# Altium schematic sheet Zynq_Power.SchDoc: Zynq Power
size A3; DrawnBy: Emre Can Damyanlı; Revision: A.1; SheetNumber: 3; SheetTotal: 4; ENG_APP_DATE: --/--/--; DSN_APP_DATE: --/--/--; CHK_APP_DATE: --/--/--
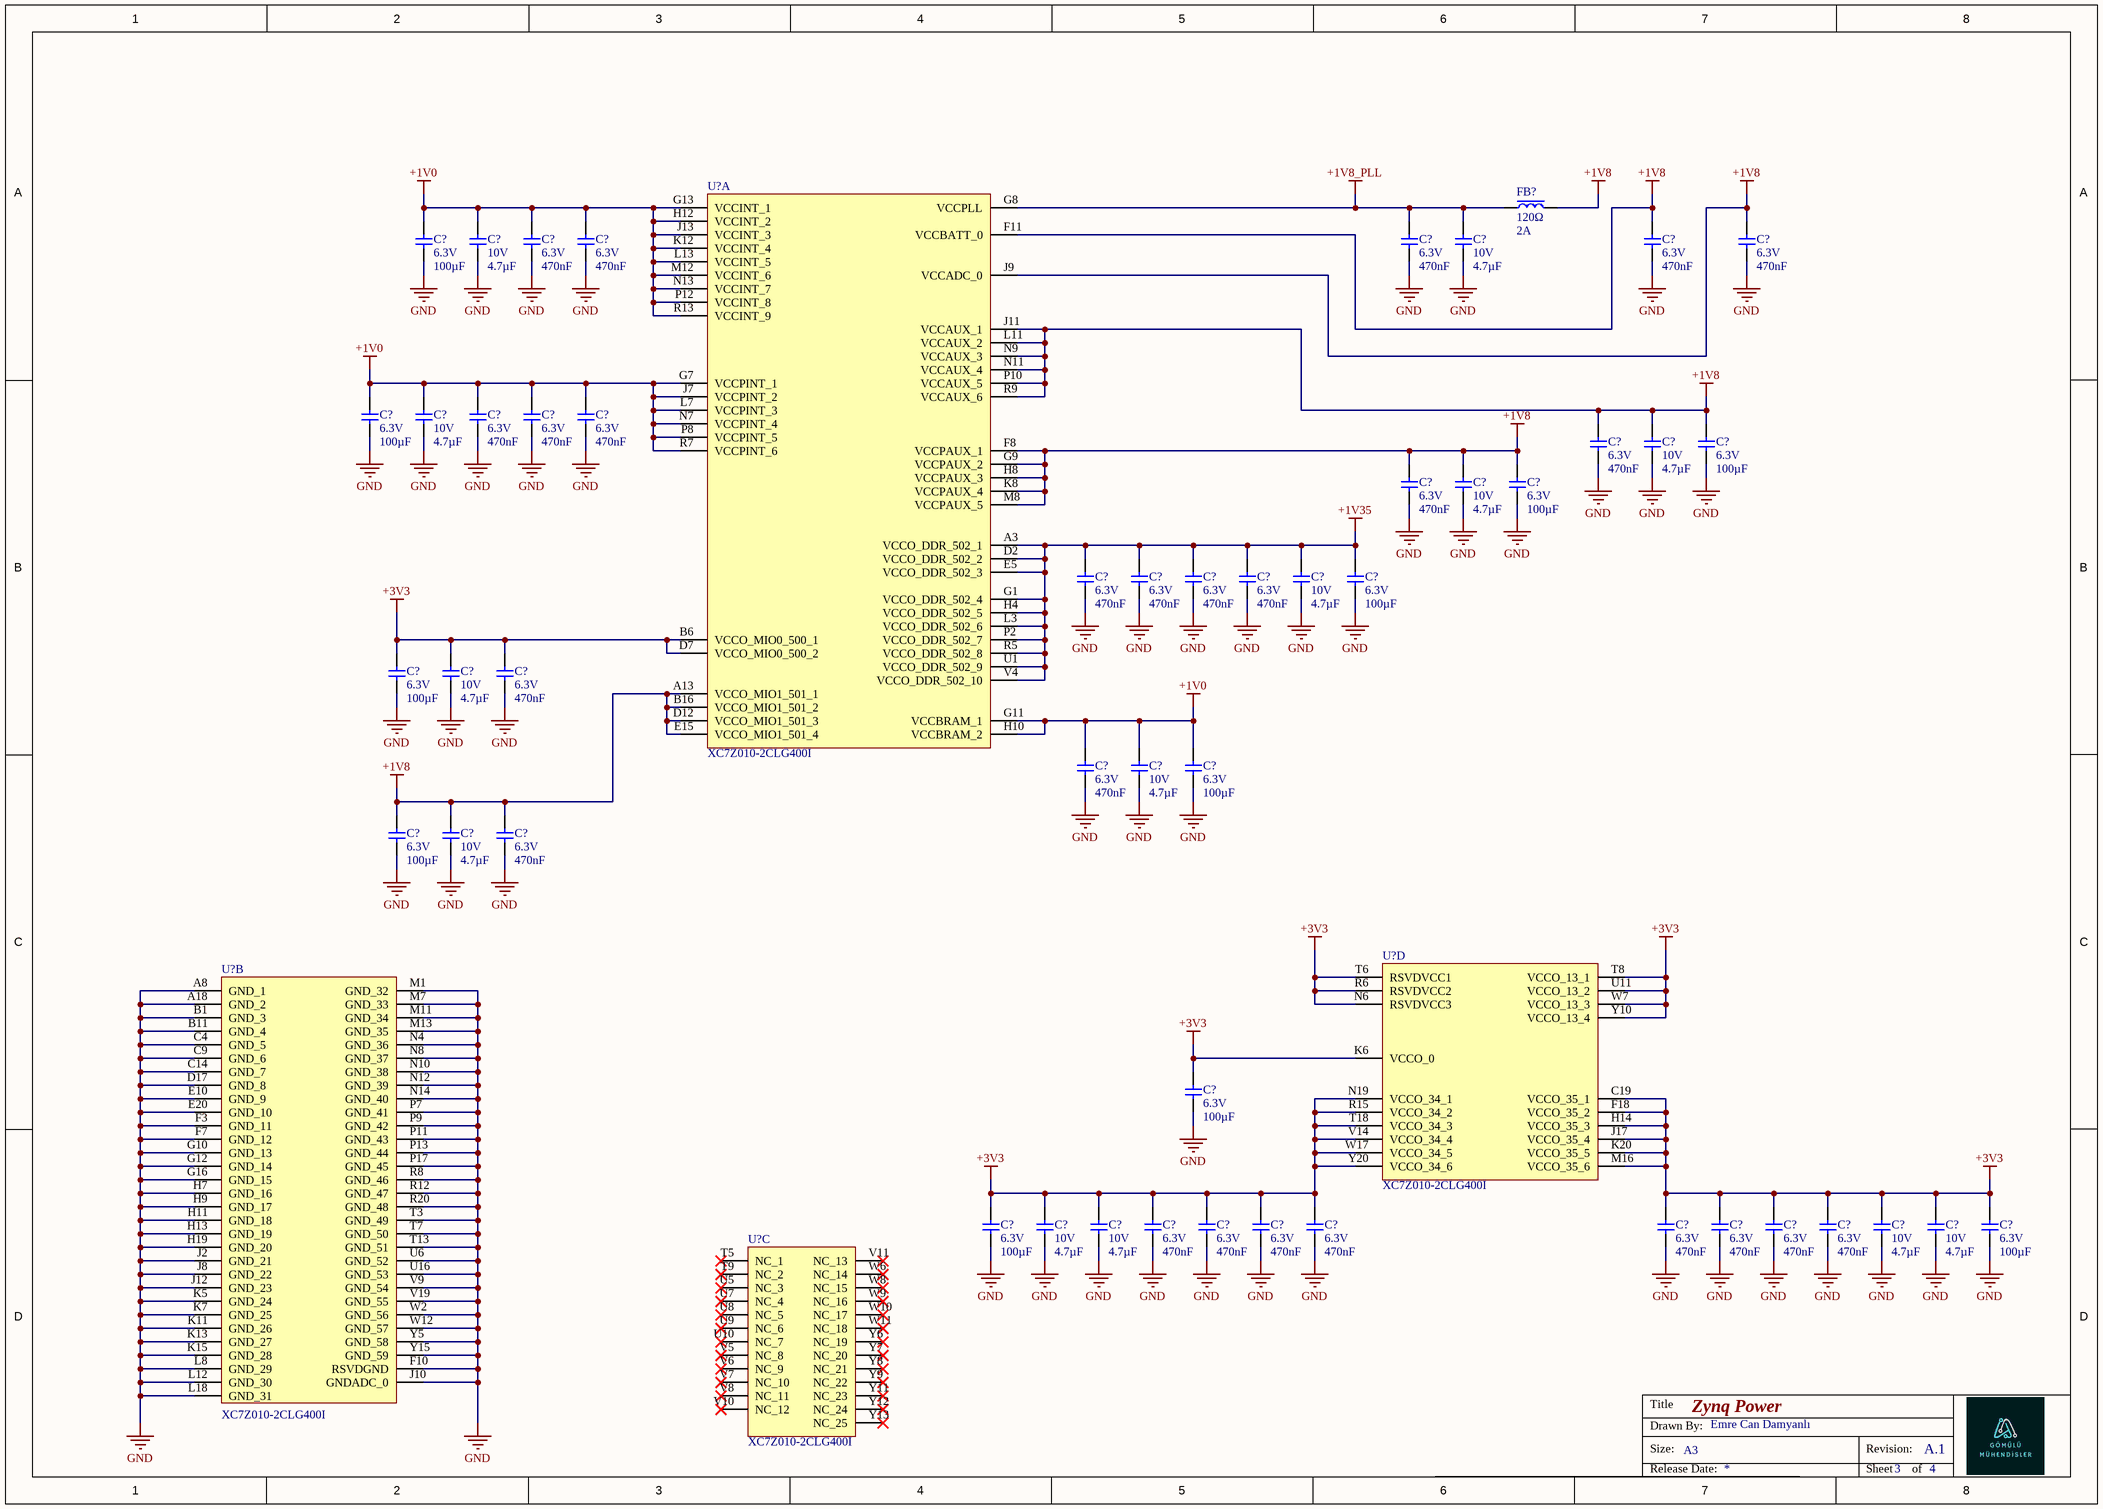
[diagram p0: Zynq_Power.SchDoc]

## Parts
(Parts that share a designator on the sheet are numbered #1, #2 ... from top to bottom, then left to right.)
C?#1  value 100µF  Voltage: 6.3V  [CAPC3225X140N]  (hidden comment: CL32A107MQVNNNE)
C?#2  value 4.7µF  Voltage Rating: 10V  [CAPC1005X55N]  (hidden comment: CL05A475MP5NRNC)
C?#3  value 470nF  Voltage Rating: 6.3V  [CAPC0603X33N]  (hidden comment: GRM033R60J474KE90D)
C?#4  value 470nF  Voltage Rating: 6.3V  [CAPC0603X33N]  (hidden comment: GRM033R60J474KE90D)
C?#5  value 470nF  Voltage Rating: 6.3V  [CAPC0603X33N]  (hidden comment: GRM033R60J474KE90D)
C?#6  value 4.7µF  Voltage Rating: 10V  [CAPC1005X55N]  (hidden comment: CL05A475MP5NRNC)
C?#7  value 470nF  Voltage Rating: 6.3V  [CAPC0603X33N]  (hidden comment: GRM033R60J474KE90D)
C?#8  value 470nF  Voltage Rating: 6.3V  [CAPC0603X33N]  (hidden comment: GRM033R60J474KE90D)
C?#9  value 100µF  Voltage: 6.3V  [CAPC3225X140N]  (hidden comment: CL32A107MQVNNNE)
C?#10  value 4.7µF  Voltage Rating: 10V  [CAPC1005X55N]  (hidden comment: CL05A475MP5NRNC)
C?#11  value 470nF  Voltage Rating: 6.3V  [CAPC0603X33N]  (hidden comment: GRM033R60J474KE90D)
C?#12  value 470nF  Voltage Rating: 6.3V  [CAPC0603X33N]  (hidden comment: GRM033R60J474KE90D)
C?#13  value 470nF  Voltage Rating: 6.3V  [CAPC0603X33N]  (hidden comment: GRM033R60J474KE90D)
C?#14  value 470nF  Voltage Rating: 6.3V  [CAPC0603X33N]  (hidden comment: GRM033R60J474KE90D)
C?#15  value 4.7µF  Voltage Rating: 10V  [CAPC1005X55N]  (hidden comment: CL05A475MP5NRNC)
C?#16  value 100µF  Voltage: 6.3V  [CAPC3225X140N]  (hidden comment: CL32A107MQVNNNE)
C?#17  value 470nF  Voltage Rating: 6.3V  [CAPC0603X33N]  (hidden comment: GRM033R60J474KE90D)
C?#18  value 4.7µF  Voltage Rating: 10V  [CAPC1005X55N]  (hidden comment: CL05A475MP5NRNC)
C?#19  value 100µF  Voltage: 6.3V  [CAPC3225X140N]  (hidden comment: CL32A107MQVNNNE)
C?#20  value 470nF  Voltage Rating: 6.3V  [CAPC0603X33N]  (hidden comment: GRM033R60J474KE90D)
C?#21  value 470nF  Voltage Rating: 6.3V  [CAPC0603X33N]  (hidden comment: GRM033R60J474KE90D)
C?#22  value 470nF  Voltage Rating: 6.3V  [CAPC0603X33N]  (hidden comment: GRM033R60J474KE90D)
C?#23  value 470nF  Voltage Rating: 6.3V  [CAPC0603X33N]  (hidden comment: GRM033R60J474KE90D)
C?#24  value 4.7µF  Voltage Rating: 10V  [CAPC1005X55N]  (hidden comment: CL05A475MP5NRNC)
C?#25  value 100µF  Voltage: 6.3V  [CAPC3225X140N]  (hidden comment: CL32A107MQVNNNE)
C?#26  value 100µF  Voltage: 6.3V  [CAPC3225X140N]  (hidden comment: CL32A107MQVNNNE)
C?#27  value 4.7µF  Voltage Rating: 10V  [CAPC1005X55N]  (hidden comment: CL05A475MP5NRNC)
C?#28  value 470nF  Voltage Rating: 6.3V  [CAPC0603X33N]  (hidden comment: GRM033R60J474KE90D)
C?#29  value 470nF  Voltage Rating: 6.3V  [CAPC0603X33N]  (hidden comment: GRM033R60J474KE90D)
C?#30  value 4.7µF  Voltage Rating: 10V  [CAPC1005X55N]  (hidden comment: CL05A475MP5NRNC)
C?#31  value 100µF  Voltage: 6.3V  [CAPC3225X140N]  (hidden comment: CL32A107MQVNNNE)
C?#32  value 100µF  Voltage: 6.3V  [CAPC3225X140N]  (hidden comment: CL32A107MQVNNNE)
C?#33  value 4.7µF  Voltage Rating: 10V  [CAPC1005X55N]  (hidden comment: CL05A475MP5NRNC)
C?#34  value 470nF  Voltage Rating: 6.3V  [CAPC0603X33N]  (hidden comment: GRM033R60J474KE90D)
C?#35  value 100µF  Voltage: 6.3V  [CAPC3225X140N]  (hidden comment: CL32A107MQVNNNE)
C?#36  value 100µF  Voltage: 6.3V  [CAPC3225X140N]  (hidden comment: CL32A107MQVNNNE)
C?#37  value 4.7µF  Voltage Rating: 10V  [CAPC1005X55N]  (hidden comment: CL05A475MP5NRNC)
C?#38  value 4.7µF  Voltage Rating: 10V  [CAPC1005X55N]  (hidden comment: CL05A475MP5NRNC)
C?#39  value 470nF  Voltage Rating: 6.3V  [CAPC0603X33N]  (hidden comment: GRM033R60J474KE90D)
C?#40  value 470nF  Voltage Rating: 6.3V  [CAPC0603X33N]  (hidden comment: GRM033R60J474KE90D)
C?#41  value 470nF  Voltage Rating: 6.3V  [CAPC0603X33N]  (hidden comment: GRM033R60J474KE90D)
C?#42  value 470nF  Voltage Rating: 6.3V  [CAPC0603X33N]  (hidden comment: GRM033R60J474KE90D)
C?#43  value 470nF  Voltage Rating: 6.3V  [CAPC0603X33N]  (hidden comment: GRM033R60J474KE90D)
C?#44  value 470nF  Voltage Rating: 6.3V  [CAPC0603X33N]  (hidden comment: GRM033R60J474KE90D)
C?#45  value 470nF  Voltage Rating: 6.3V  [CAPC0603X33N]  (hidden comment: GRM033R60J474KE90D)
C?#46  value 470nF  Voltage Rating: 6.3V  [CAPC0603X33N]  (hidden comment: GRM033R60J474KE90D)
C?#47  value 4.7µF  Voltage Rating: 10V  [CAPC1005X55N]  (hidden comment: CL05A475MP5NRNC)
C?#48  value 4.7µF  Voltage Rating: 10V  [CAPC1005X55N]  (hidden comment: CL05A475MP5NRNC)
C?#49  value 100µF  Voltage: 6.3V  [CAPC3225X140N]  (hidden comment: CL32A107MQVNNNE)
FB?  Impedance: 120Ω  Max Current Rating: 2A  [FERRITE_0402]  (hidden comment: BLM15PX121SN1D)
U?#1  XC7Z010-2CLG400I  [BGA400C80P20X20_1700X1700X160]  (part A of 9)
U?#2  XC7Z010-2CLG400I  [BGA400C80P20X20_1700X1700X160]  (part D of 9)
U?#3  XC7Z010-2CLG400I  [BGA400C80P20X20_1700X1700X160]  (part B of 9)
U?#4  XC7Z010-2CLG400I  [BGA400C80P20X20_1700X1700X160]  (part C of 9)

## Nets
+1V0: C?#1.2 C?#2.2 C?#3.2 C?#4.2 C?#9.2 C?#10.2 C?#11.2 C?#12.2 C?#13.2 C?#29.2 C?#30.2 C?#31.2 U?#1.G7(VCCPINT_1) U?#1.G11(VCCBRAM_1) U?#1.G13(VCCINT_1) U?#1.H10(VCCBRAM_2) U?#1.H12(VCCINT_2) U?#1.J7(VCCPINT_2) U?#1.J13(VCCINT_3) U?#1.K12(VCCINT_4) U?#1.L7(VCCPINT_3) U?#1.L13(VCCINT_5) U?#1.M12(VCCINT_6) U?#1.N7(VCCPINT_4) U?#1.N13(VCCINT_7) U?#1.P8(VCCPINT_5) U?#1.P12(VCCINT_8) U?#1.R7(VCCPINT_6) U?#1.R13(VCCINT_9)
+1V8: C?#7.2 C?#8.2 C?#14.2 C?#15.2 C?#16.2 C?#17.2 C?#18.2 C?#19.2 C?#32.2 C?#33.2 C?#34.2 FB?.2 U?#1.A13(VCCO_MIO1_501_1) U?#1.B16(VCCO_MIO1_501_2) U?#1.D12(VCCO_MIO1_501_3) U?#1.E15(VCCO_MIO1_501_4) U?#1.F8(VCCPAUX_1) U?#1.F11(VCCBATT_0) U?#1.G9(VCCPAUX_2) U?#1.H8(VCCPAUX_3) U?#1.J9(VCCADC_0) U?#1.J11(VCCAUX_1) U?#1.K8(VCCPAUX_4) U?#1.L11(VCCAUX_2) U?#1.M8(VCCPAUX_5) U?#1.N9(VCCAUX_3) U?#1.N11(VCCAUX_4) U?#1.P10(VCCAUX_5) U?#1.R9(VCCAUX_6)
+1V8_PLL: C?#5.2 C?#6.2 FB?.1 U?#1.G8(VCCPLL)
+1V35: C?#20.2 C?#21.2 C?#22.2 C?#23.2 C?#24.2 C?#25.2 U?#1.A3(VCCO_DDR_502_1) U?#1.D2(VCCO_DDR_502_2) U?#1.E5(VCCO_DDR_502_3) U?#1.G1(VCCO_DDR_502_4) U?#1.H4(VCCO_DDR_502_5) U?#1.L3(VCCO_DDR_502_6) U?#1.P2(VCCO_DDR_502_7) U?#1.R5(VCCO_DDR_502_8) U?#1.U1(VCCO_DDR_502_9) U?#1.V4(VCCO_DDR_502_10)
+3V3: C?#26.2 C?#27.2 C?#28.2 C?#35.2 C?#36.2 C?#37.2 C?#38.2 C?#39.2 C?#40.2 C?#41.2 C?#42.2 C?#43.2 C?#44.2 C?#45.2 C?#46.2 C?#47.2 C?#48.2 C?#49.2 U?#1.B6(VCCO_MIO0_500_1) U?#1.D7(VCCO_MIO0_500_2) U?#2.C19(VCCO_35_1) U?#2.F18(VCCO_35_2) U?#2.H14(VCCO_35_3) U?#2.J17(VCCO_35_4) U?#2.K6(VCCO_0) U?#2.K20(VCCO_35_5) U?#2.M16(VCCO_35_6) U?#2.N6(RSVDVCC3) U?#2.N19(VCCO_34_1) U?#2.R6(RSVDVCC2) U?#2.R15(VCCO_34_2) U?#2.T6(RSVDVCC1) U?#2.T8(VCCO_13_1) U?#2.T18(VCCO_34_3) U?#2.U11(VCCO_13_2) U?#2.V14(VCCO_34_4) U?#2.W7(VCCO_13_3) U?#2.W17(VCCO_34_5) U?#2.Y10(VCCO_13_4) U?#2.Y20(VCCO_34_6)
GND: C?#1.1 C?#2.1 C?#3.1 C?#4.1 C?#5.1 C?#6.1 C?#7.1 C?#8.1 C?#9.1 C?#10.1 C?#11.1 C?#12.1 C?#13.1 C?#14.1 C?#15.1 C?#16.1 C?#17.1 C?#18.1 C?#19.1 C?#20.1 C?#21.1 C?#22.1 C?#23.1 C?#24.1 C?#25.1 C?#26.1 C?#27.1 C?#28.1 C?#29.1 C?#30.1 C?#31.1 C?#32.1 C?#33.1 C?#34.1 C?#35.1 C?#36.1 C?#37.1 C?#38.1 C?#39.1 C?#40.1 C?#41.1 C?#42.1 C?#43.1 C?#44.1 C?#45.1 C?#46.1 C?#47.1 C?#48.1 C?#49.1 U?#3.A8(GND_1) U?#3.A18(GND_2) U?#3.B1(GND_3) U?#3.B11(GND_4) U?#3.C4(GND_5) U?#3.C9(GND_6) U?#3.C14(GND_7) U?#3.D17(GND_8) U?#3.E10(GND_9) U?#3.E20(GND_10) U?#3.F3(GND_11) U?#3.F7(GND_12) U?#3.F10(RSVDGND) U?#3.G10(GND_13) U?#3.G12(GND_14) U?#3.G16(GND_15) U?#3.H7(GND_16) U?#3.H9(GND_17) U?#3.H11(GND_18) U?#3.H13(GND_19) U?#3.H19(GND_20) U?#3.J2(GND_21) U?#3.J8(GND_22) U?#3.J10(GNDADC_0) U?#3.J12(GND_23) U?#3.K5(GND_24) U?#3.K7(GND_25) U?#3.K11(GND_26) U?#3.K13(GND_27) U?#3.K15(GND_28) U?#3.L8(GND_29) U?#3.L12(GND_30) U?#3.L18(GND_31) U?#3.M1(GND_32) U?#3.M7(GND_33) U?#3.M11(GND_34) U?#3.M13(GND_35) U?#3.N4(GND_36) U?#3.N8(GND_37) U?#3.N10(GND_38) U?#3.N12(GND_39) U?#3.N14(GND_40) U?#3.P7(GND_41) U?#3.P9(GND_42) U?#3.P11(GND_43) U?#3.P13(GND_44) U?#3.P17(GND_45) U?#3.R8(GND_46) U?#3.R12(GND_47) U?#3.R20(GND_48) U?#3.T3(GND_49) U?#3.T7(GND_50) U?#3.T13(GND_51) U?#3.U6(GND_52) U?#3.U16(GND_53) U?#3.V9(GND_54) U?#3.V19(GND_55) U?#3.W2(GND_56) U?#3.W12(GND_57) U?#3.Y5(GND_58) U?#3.Y15(GND_59)

Not connected (* = marked no-connect by the designer): U?#4 T5(NC_1)* T9(NC_2)* U5(NC_3)* U7(NC_4)* U8(NC_5)* U9(NC_6)* U10(NC_7)* V5(NC_8)* V6(NC_9)* V7(NC_10)* V8(NC_11)* V10(NC_12)* V11(NC_13)* W6(NC_14)* W8(NC_15)* W9(NC_16)* W10(NC_17)* W11(NC_18)* Y6(NC_19)* Y7(NC_20)* Y8(NC_21)* Y9(NC_22)* Y11(NC_23)* Y12(NC_24)* Y13(NC_25)*

## Notes on the sheet
- Title
- Size:
- Drawn By:
- A3
- Revision:
- Release Date:
- Sheet
- of

## Library data of the parts
C?#1 C?#9 C?#16 C?#19 C?#25 C?#26 C?#31 C?#32 C?#35 C?#36 C?#49 = CL32A107MQVNNNE: 6.3V 100uF X5R ±20% 1210 Multilayer Ceramic Capacitors MLCC - SMD/SMT ROHS; Manufacturer: Samsung Electro-Mechanics; Supplier: Avnet; Supplier Part Number: 82AC9521; Manufacturer Part Number: CL32A107MQVNNNE; RoHS: Compliant; Category: Ceramic Capacitors; Stock: 76691; Pricing: 1=0,707, 10=0,427, 25=0,371, 50=0,315, 100=0,28 (USD); Case/Package: 1210; Case Code (Imperial): 1210; Case Code (Metric): 3225; China RoHS: Compliant; Contact Plating: Tin; Depth: 2.5mm; Dielectric: X5R; Dielectric Material: Ceramic; Height: 2.8mm; Lead Free: Lead Free; Length: 3.2mm; Lifecycle Status: Production; Material: Ceramic; Max Operating Temperature: 85°C; Min Operating Temperature: -55°C; Mounting Technology: Surface Mount; Number of Terminals: 2; Radiation Hardening: No; REACH SVHC: Yes; Schedule B: 8532240020, 8532240020|8532240020|8532240020|8532240020|8532240020|8532240020|8532240020|8532240020|8532240020|8532240020|8532240020|8532240020|8532240020|8532240020|8532240020|8532240020|8532240020|8532240020|8532240020|8532240020|8532240020|8532240020|8532240020|85; Thickness: 2.794mm; Tolerance: 20%; Voltage Rating: 6.3V; Voltage Rating (DC): 6.3V; Width: 2.5mm; ComponentLink1URL: https://datasheet.octopart.com:443/CL32A107MQVNNNE-Samsung-Electro-Mechanics-datasheet-181552186.pdf?src-supplier=Farnell; ComponentLink1Description: https://datasheet.octopart.com:443/CL32A107MQVNNNE-Samsung-Electro-Mechanics-datasheet-181552186.pdf?src-supplier=Farnell; ComponentLink2URL: https://datasheet.octopart.com:443/CL32A107MQVNNNE-Samsung-Electro-Mechanics-datasheet-136031867.pdf?src-supplier=Samsung+SCT; ComponentLink2Description: https://datasheet.octopart.com:443/CL32A107MQVNNNE-Samsung-Electro-Mechanics-datasheet-136031867.pdf?src-supplier=Samsung+SCT; ComponentLink3URL: https://datasheet.octopart.com:443/CL32A107MQVNNNE-Samsung-Electro-Mechanics-datasheet-11731531.pdf?src-supplier=Future+Electronics; ComponentLink3Description: https://datasheet.octopart.com:443/CL32A107MQVNNNE-Samsung-Electro-Mechanics-datasheet-11731531.pdf?src-supplier=Future+Electronics; ComponentLink4URL: https://datasheet.octopart.com:443/CL32A107MQVNNNE-Samsung-Electro-Mechanics-datasheet-149048019.pdf?src-supplier=Future+Electronics; ComponentLink4Description: https://datasheet.octopart.com:443/CL32A107MQVNNNE-Samsung-Electro-Mechanics-datasheet-149048019.pdf?src-supplier=Future+Electronics; ComponentLink5URL: https://datasheet.octopart.com:443/CL32A107MQVNNNE-Samsung-Electro-Mechanics-datasheet-110334290.pdf?src-supplier=Future+Electronics; ComponentLink5Description: https://datasheet.octopart.com:443/CL32A107MQVNNNE-Samsung-Electro-Mechanics-datasheet-110334290.pdf?src-supplier=Future+Electronics; ComponentLink6URL: https://datasheet.octopart.com:443/CL32A107MQVNNNE-Samsung-Electro-Mechanics-datasheet-81462611.pdf?src-supplier=Future+Electronics; ComponentLink6Description: https://datasheet.octopart.com:443/CL32A107MQVNNNE-Samsung-Electro-Mechanics-datasheet-81462611.pdf?src-supplier=Future+Electronics; ComponentLink7URL: https://datasheet.octopart.com:443/CL32A107MQVNNNE-Samsung-datasheet-48757337.pdf?src-supplier=Future+Electronics; ComponentLink7Description: https://datasheet.octopart.com:443/CL32A107MQVNNNE-Samsung-datasheet-48757337.pdf?src-supplier=Future+Electronics; ComponentLink8URL: https://datasheet.octopart.com:443/CL32A107MQVNNNE-Samsung-datasheet-34175070.pdf?src-supplier=Future+Electronics; ComponentLink8Description: https://datasheet.octopart.com:443/CL32A107MQVNNNE-Samsung-datasheet-34175070.pdf?src-supplier=Future+Electronics; ComponentLink9URL: https://datasheet.octopart.com/CL32A107MQVNNNE-Samsung-Electro-Mechanics-datasheet-8324245.pdf; ComponentLink9Description: https://datasheet.octopart.com/CL32A107MQVNNNE-Samsung-Electro-Mechanics-datasheet-8324245.pdf; ComponentLink10URL: https://datasheet.octopart.com/CL32A107MQVNNNE-Samsung-Electro-Mechanics-datasheet-97040617.pdf; ComponentLink10Description: https://datasheet.octopart.com/CL32A107MQVNNNE-Samsung-Electro-Mechanics-datasheet-97040617.pdf; ComponentLink11URL: https://datasheet.octopart.com/General-Multilayer-Ceramic-Capacitors-Samsung-datasheet-family-111.pdf; ComponentLink11Description: https://datasheet.octopart.com/General-Multilayer-Ceramic-Capacitors-Samsung-datasheet-family-111.pdf; ComponentLink12URL: https://datasheet.octopart.com:443/CL32A107MQVNNNE-Samsung-datasheet-151956601.pdf?src-supplier=SOS+electronic; ComponentLink12Description: https://datasheet.octopart.com:443/CL32A107MQVNNNE-Samsung-datasheet-151956601.pdf?src-supplier=SOS+electronic; ComponentLink13URL: https://datasheet.octopart.com:443/CL32A107MQVNNNE-Samsung-datasheet-151956603.pdf?src-supplier=SOS+electronic; ComponentLink13Description: https://datasheet.octopart.com:443/CL32A107MQVNNNE-Samsung-datasheet-151956603.pdf?src-supplier=SOS+electronic; ComponentLink14URL: https://datasheet.octopart.com:443/CL32A107MQVNNNE-Samsung-datasheet-8326407.pdf?src-supplier=TME; ComponentLink14Description: https://datasheet.octopart.com:443/CL32A107MQVNNNE-Samsung-datasheet-8326407.pdf?src-supplier=TME; ComponentLink15URL: http://sigma.octopart.com:80/rohs_certificate/General-Multilayer-Ceramic-Capacitors-Samsung-family-110.pdf?src-supplier=Compliance+Statements; ComponentLink15Description: http://sigma.octopart.com:80/rohs_certificate/General-Multilayer-Ceramic-Capacitors-Samsung-family-110.pdf?src-supplier=Compliance+Statements; ComponentLink16URL: http://sigma.octopart.com:80/rohs_statement/General-Multilayer-Ceramic-Capacitors-Samsung-family-132.pdf?src-supplier=Compliance+Statements; ComponentLink16Description: http://sigma.octopart.com:80/rohs_statement/General-Multilayer-Ceramic-Capacitors-Samsung-family-132.pdf?src-supplier=Compliance+Statements; ComponentLink17URL: http://sigma.octopart.com:80/reach_statement/General-Multilayer-Ceramic-Capacitors-Samsung-family-133.pdf?src-supplier=Compliance+Statements; ComponentLink17Description: http://sigma.octopart.com:80/reach_statement/General-Multilayer-Ceramic-Capacitors-Samsung-family-133.pdf?src-supplier=Compliance+Statements
C?#2 C?#6 C?#10 C?#15 C?#18 C?#24 C?#27 C?#30 C?#33 C?#37 C?#38 C?#47 C?#48 = CL05A475MP5NRNC: Ceramic Capacitor, Multilayer, Ceramic, 10V, 20% +Tol, 20% -Tol, X5R, +-15% TC, 4.7uF, Surface Mount, 0402 inch; Manufacturer: Samsung Electro-Mechanics; Supplier: Avnet; Supplier Part Number: CL05A475MP5NRNC; Manufacturer Part Number: CL05A475MP5NRNC; RoHS: Compliant; Category: Ceramic Capacitors; Stock: 40000; Pricing: 10000=0,00671, 20000=0,00663, 40000=0,0066, 80000=0,00656, 160000=0,00653 (USD); Case/Package: 0402; Case Code (Imperial): 0402; Case Code (Metric): 1005; China RoHS: Compliant; Dielectric: X5R; Dielectric Material: Ceramic; Height: 500µm; Lead Free: Lead Free; Length: 1mm; Lifecycle Status: Production; Material: Ceramic; Max Operating Temperature: 85°C; Min Operating Temperature: -55°C; Mounting Technology: Surface Mount; Number of Terminals: 2; REACH SVHC: Yes; Schedule B: 8532240020, 8532240020|8532240020|8532240020|8532240020|8532240020|8532240020|8532240020|8532240020|8532240020|8532240020|8532240020|8532240020|8532240020|8532240020|8532240020|8532240020|8532240020|8532240020|8532240020|8532240020|8532240020|8532240020, 8532240020|8532240020|8532240020|8532240020|8532240020|8532240020|8532240020|8532240020|8532240020|8532240020|8532240020|8532240020|8532240020|8532240020|8532240020|8532240020|8532240020|8532240020|8532240020|8532240020|8532240020|8532240020|8532240020, 8532240020|8532240020|8532240020|8532240020|8532240020|8532240020|8532240020|8532240020|8532240020|8532240020|8532240020|8532240020|8532240020|8532240020|8532240020|8532240020|8532240020|8532240020|8532240020|8532240020|8532240020|8532240020|8532240020|85; Thickness: 558.8µm; Tolerance: 20%; Voltage Rating (DC): 10V; Width: 500µm; ComponentLink1URL: https://datasheet.octopart.com:443/CL05A475MP5NRNC-Samsung-Electro-Mechanics-datasheet-181551186.pdf?src-supplier=Newark; ComponentLink1Description: https://datasheet.octopart.com:443/CL05A475MP5NRNC-Samsung-Electro-Mechanics-datasheet-181551186.pdf?src-supplier=Newark; ComponentLink2URL: https://datasheet.octopart.com:443/CL05A475MP5NRNC-Samsung-Electro-Mechanics-datasheet-136482298.pdf?src-supplier=Newark; ComponentLink2Description: https://datasheet.octopart.com:443/CL05A475MP5NRNC-Samsung-Electro-Mechanics-datasheet-136482298.pdf?src-supplier=Newark; ComponentLink3URL: https://datasheet.octopart.com:443/CL05A475MP5NRNC-Samsung-Electro-Mechanics-datasheet-136031736.pdf?src-supplier=Future+Electronics; ComponentLink3Description: https://datasheet.octopart.com:443/CL05A475MP5NRNC-Samsung-Electro-Mechanics-datasheet-136031736.pdf?src-supplier=Future+Electronics; ComponentLink4URL: https://datasheet.octopart.com:443/CL05A475MP5NRNC-Samsung-Electro-Mechanics-datasheet-110226226.pdf?src-supplier=Future+Electronics; ComponentLink4Description: https://datasheet.octopart.com:443/CL05A475MP5NRNC-Samsung-Electro-Mechanics-datasheet-110226226.pdf?src-supplier=Future+Electronics; ComponentLink5URL: https://datasheet.octopart.com:443/CL05A475MP5NRNC-Samsung-Electro-Mechanics-datasheet-87580058.pdf?src-supplier=Future+Electronics; ComponentLink5Description: https://datasheet.octopart.com:443/CL05A475MP5NRNC-Samsung-Electro-Mechanics-datasheet-87580058.pdf?src-supplier=Future+Electronics; ComponentLink6URL: https://datasheet.octopart.com:443/CL05A475MP5NRNC-Samsung-Electro-Mechanics-datasheet-81461611.pdf?src-supplier=Future+Electronics; ComponentLink6Description: https://datasheet.octopart.com:443/CL05A475MP5NRNC-Samsung-Electro-Mechanics-datasheet-81461611.pdf?src-supplier=Future+Electronics; ComponentLink7URL: https://datasheet.octopart.com:443/CL05A475MP5NRNC-Samsung-datasheet-48647200.pdf?src-supplier=Future+Electronics; ComponentLink7Description: https://datasheet.octopart.com:443/CL05A475MP5NRNC-Samsung-datasheet-48647200.pdf?src-supplier=Future+Electronics; ComponentLink8URL: https://datasheet.octopart.com:443/CL05A475MP5NRNC-Samsung-datasheet-34153549.pdf?src-supplier=Future+Electronics; ComponentLink8Description: https://datasheet.octopart.com:443/CL05A475MP5NRNC-Samsung-datasheet-34153549.pdf?src-supplier=Future+Electronics; ComponentLink9URL: https://datasheet.octopart.com:443/CL05A475MP5NRNC-Samsung-datasheet-26589015.pdf?src-supplier=Future+Electronics; ComponentLink9Description: https://datasheet.octopart.com:443/CL05A475MP5NRNC-Samsung-datasheet-26589015.pdf?src-supplier=Future+Electronics; ComponentLink10URL: https://datasheet.octopart.com:443/CL05A475MP5NRNC-Samsung-datasheet-8324245.pdf?src-supplier=Future+Electronics; ComponentLink10Description: https://datasheet.octopart.com:443/CL05A475MP5NRNC-Samsung-datasheet-8324245.pdf?src-supplier=Future+Electronics; ComponentLink11URL: https://datasheet.octopart.com:443/CL05A475MP5NRNC-Samsung-Electro-Mechanics-datasheet-149136695.pdf?src-supplier=Future+Electronics; ComponentLink11Description: https://datasheet.octopart.com:443/CL05A475MP5NRNC-Samsung-Electro-Mechanics-datasheet-149136695.pdf?src-supplier=Future+Electronics; ComponentLink12URL: https://datasheet.octopart.com:443/CL05A475MP5NRNC-Samsung-datasheet-8326407.pdf?src-supplier=TME; ComponentLink12Description: https://datasheet.octopart.com:443/CL05A475MP5NRNC-Samsung-datasheet-8326407.pdf?src-supplier=TME
C?#3-C?#5 C?#7 C?#8 C?#11-C?#14 C?#17 C?#20-C?#23 C?#28 C?#29 C?#34 C?#39-C?#46 = GRM033R60J474KE90D: Ceramic Capacitor, Ceramic, 6.3V, 10% +Tol, 10% -Tol, X5R, 15% TC, 0.47uF, Surface Mount, 0201; Manufacturer: Murata; Manufacturer Lifecycle Status: IN PRODUCTION; Supplier: Arrow Electronics; Supplier Part Number: GRM033R60J474KE90D; Manufacturer Part Number: GRM033R60J474KE90D; RoHS: Compliant; Category: Ceramic Capacitors; Stock: 1170000; Pricing: 15000=0,004 (USD); Case/Package: 0201; Case Code (Imperial): 0201; Case Code (Metric): 0603; Depth: 300µm; Dielectric: X5R; Dielectric Material: Ceramic; Height: 300µm; Lead Free: Lead Free; Length: 600µm; Lifecycle Status: Production; Material: Ceramic; Max Operating Temperature: 85°C; Min Operating Temperature: -55°C; Mounting Technology: Surface Mount; Number of Terminals: 2; Packaging: Tape & Reel (TR); REACH SVHC: Yes; Schedule B: 8532240020, 8532240020|8532240020, 8532240020|8532240020|8532240020, 8532240020|8532240020|8532240020|8532240020; Termination: SMD/SMT; Thickness: 300µm; Tolerance: 10%; Voltage Rating (DC): 6.3V; Weight: 340.194278µg; Width: 300µm; ComponentLink1URL: https://datasheet.octopart.com:443/GRM033R60J474KE90D-Murata-datasheet-165579666.pdf?src-supplier=TME; ComponentLink1Description: https://datasheet.octopart.com:443/GRM033R60J474KE90D-Murata-datasheet-165579666.pdf?src-supplier=TME; ComponentLink2URL: https://datasheet.octopart.com:443/GRM033R60J474KE90D-Murata-datasheet-141274201.pdf?src-supplier=Ciiva; ComponentLink2Description: https://datasheet.octopart.com:443/GRM033R60J474KE90D-Murata-datasheet-141274201.pdf?src-supplier=Ciiva; ComponentLink3URL: https://datasheet.octopart.com:443/GRM033R60J474KE90D-Murata-datasheet-140676048.pdf?src-supplier=Ciiva; ComponentLink3Description: https://datasheet.octopart.com:443/GRM033R60J474KE90D-Murata-datasheet-140676048.pdf?src-supplier=Ciiva; ComponentLink4URL: https://datasheet.octopart.com:443/GRM033R60J474KE90D-Murata-datasheet-138738366.pdf?src-supplier=Ciiva; ComponentLink4Description: https://datasheet.octopart.com:443/GRM033R60J474KE90D-Murata-datasheet-138738366.pdf?src-supplier=Ciiva; ComponentLink5URL: https://datasheet.octopart.com:443/GRM033R60J474KE90D-Murata-datasheet-22122223.pdf?src-supplier=Future+Electronics; ComponentLink5Description: https://datasheet.octopart.com:443/GRM033R60J474KE90D-Murata-datasheet-22122223.pdf?src-supplier=Future+Electronics; ComponentLink6URL: https://datasheet.octopart.com/GRM033R60J474KE90D-Murata-datasheet-12515295.pdf; ComponentLink6Description: https://datasheet.octopart.com/GRM033R60J474KE90D-Murata-datasheet-12515295.pdf; ComponentLink7URL: https://datasheet.octopart.com/GRM033R60J474KE90D-Murata-datasheet-12510076.pdf; ComponentLink7Description: https://datasheet.octopart.com/GRM033R60J474KE90D-Murata-datasheet-12510076.pdf; ComponentLink8URL: https://datasheet.octopart.com/GRM033R60J474KE90D-Murata-datasheet-11978611.pdf; ComponentLink8Description: https://datasheet.octopart.com/GRM033R60J474KE90D-Murata-datasheet-11978611.pdf; ComponentLink9URL: https://datasheet.octopart.com/GRM033R60J474KE90D-Murata-datasheet-10025737.pdf; ComponentLink9Description: https://datasheet.octopart.com/GRM033R60J474KE90D-Murata-datasheet-10025737.pdf; ComponentLink10URL: https://datasheet.octopart.com/GRM033R60J474KE90D-Murata-datasheet-8819587.pdf; ComponentLink10Description: https://datasheet.octopart.com/GRM033R60J474KE90D-Murata-datasheet-8819587.pdf; ComponentLink11URL: https://datasheet.octopart.com/GRM033R60J474KE90D-Murata-datasheet-17503195.pdf; ComponentLink11Description: https://datasheet.octopart.com/GRM033R60J474KE90D-Murata-datasheet-17503195.pdf; ComponentLink12URL: https://datasheet.octopart.com:443/GRM033R60J474KE90D-Murata-datasheet-150839311.pdf?src-supplier=Arrow.cn; ComponentLink12Description: https://datasheet.octopart.com:443/GRM033R60J474KE90D-Murata-datasheet-150839311.pdf?src-supplier=Arrow.cn; ComponentLink13URL: http://sigma.octopart.com:80/reach_statement/Murata-company-16.pdf?src-supplier=Compliance+Statements; ComponentLink13Description: http://sigma.octopart.com:80/reach_statement/Murata-company-16.pdf?src-supplier=Compliance+Statements
FB? = BLM15PX121SN1D: Ferrite Beads Multi-Layer 120Ohm 25% 100MHz 2A 0.055Ohm DCR 0402 T/R; Manufacturer: Murata; Current Rating: 1.1A; DC Resistance (DCR): 55mΩ; Material: Steel; Number of Circuits: 1; Supplier: Arrow Electronics; Supplier Part Number: BLM15PX121SN1D; Manufacturer Part Number: BLM15PX121SN1D; RoHS: Compliant; Category: Ferrite Beads and Chips; Stock: 81241; Pricing: 4237=0,0236, 6000=0,023, 15000=0,023, 30000=0,022, 75000=0,022 (USD); Case/Package: 0402; Case Code (Imperial): 0402; Case Code (Metric): 1005; Contact Plating: Tin; Core Material: Ferrite; Height: 500µm; Lead Free: Lead Free; Length: 1mm; Lifecycle Status: Production; Max DC Current: 2A; Max Operating Temperature: 125°C; Min Operating Temperature: -55°C; Number of Lines: 1; Pins: 2; Number of Terminals: 2; Packaging: Tape and Reel; REACH SVHC: Yes; RMS Current (Irms): 2A; Schedule B: 8504500000, 8504500000|8504500000, 8504500000|8504500000|8504500000, 8504500000|8504500000|8504500000|8504500000; ESR: 55mΩ; Termination: SMD/SMT; Test Frequency: 100MHz; Tolerance: 25%; Weight: 652.039032µg; Width: 500µm; ComponentLink1URL: https://datasheet.octopart.com:443/BLM15PX121SN1D-Murata-datasheet-180806543.pdf?src-supplier=IHS; ComponentLink1Description: https://datasheet.octopart.com:443/BLM15PX121SN1D-Murata-datasheet-180806543.pdf?src-supplier=IHS; ComponentLink2URL: https://datasheet.octopart.com:443/BLM15PX121SN1D-Murata-datasheet-12522583.pdf?src-supplier=Upverter; ComponentLink2Description: https://datasheet.octopart.com:443/BLM15PX121SN1D-Murata-datasheet-12522583.pdf?src-supplier=Upverter; ComponentLink3URL: https://datasheet.octopart.com:443/BLM15PX121SN1D-Murata-datasheet-10083551.pdf?src-supplier=Upverter; ComponentLink3Description: https://datasheet.octopart.com:443/BLM15PX121SN1D-Murata-datasheet-10083551.pdf?src-supplier=Upverter; ComponentLink4URL: https://datasheet.octopart.com:443/BLM15PX121SN1D-Murata-datasheet-8508678.pdf?src-supplier=Upverter; ComponentLink4Description: https://datasheet.octopart.com:443/BLM15PX121SN1D-Murata-datasheet-8508678.pdf?src-supplier=Upverter; ComponentLink5URL: https://datasheet.octopart.com:443/BLM15PX121SN1D-Murata-datasheet-39128427.pdf?src-supplier=Newark; ComponentLink5Description: https://datasheet.octopart.com:443/BLM15PX121SN1D-Murata-datasheet-39128427.pdf?src-supplier=Newark; ComponentLink6URL: https://datasheet.octopart.com:443/BLM15PX121SN1D-Murata-datasheet-166171473.pdf?src-supplier=TME; ComponentLink6Description: https://datasheet.octopart.com:443/BLM15PX121SN1D-Murata-datasheet-166171473.pdf?src-supplier=TME; ComponentLink7URL: https://datasheet.octopart.com:443/BLM15PX121SN1D-Murata-datasheet-141257890.pdf?src-supplier=Ciiva; ComponentLink7Description: https://datasheet.octopart.com:443/BLM15PX121SN1D-Murata-datasheet-141257890.pdf?src-supplier=Ciiva; ComponentLink8URL: https://datasheet.octopart.com:443/BLM15PX121SN1D-Murata-datasheet-138706708.pdf?src-supplier=Ciiva; ComponentLink8Description: https://datasheet.octopart.com:443/BLM15PX121SN1D-Murata-datasheet-138706708.pdf?src-supplier=Ciiva; ComponentLink9URL: https://datasheet.octopart.com:443/BLM15PX121SN1D-Murata-datasheet-78375072.pdf?src-supplier=Future+Electronics; ComponentLink9Description: https://datasheet.octopart.com:443/BLM15PX121SN1D-Murata-datasheet-78375072.pdf?src-supplier=Future+Electronics; ComponentLink10URL: https://datasheet.octopart.com:443/BLM15PX121SN1D-Murata-datasheet-13563506.pdf?src-supplier=Future+Electronics; ComponentLink10Description: https://datasheet.octopart.com:443/BLM15PX121SN1D-Murata-datasheet-13563506.pdf?src-supplier=Future+Electronics; ComponentLink11URL: https://datasheet.octopart.com:443/BLM15PX121SN1D-Murata-datasheet-12545319.pdf?src-supplier=Future+Electronics; ComponentLink11Description: https://datasheet.octopart.com:443/BLM15PX121SN1D-Murata-datasheet-12545319.pdf?src-supplier=Future+Electronics; ComponentLink12URL: https://datasheet.octopart.com/BLM15PX121SN1D-Murata-datasheet-37129980.pdf; ComponentLink12Description: https://datasheet.octopart.com/BLM15PX121SN1D-Murata-datasheet-37129980.pdf; ComponentLink13URL: http://sigma.octopart.com:80/reach_statement/Murata-company-16.pdf?src-supplier=Compliance+Statements; ComponentLink13Description: http://sigma.octopart.com:80/reach_statement/Murata-company-16.pdf?src-supplier=Compliance+Statements
U?#1-U?#4 = XC7Z010-2CLG400I: MPU Zynq-7000 Thumb-2 32-Bit 733MHz 1.2V/3.3V 400-Pin CS-BGA; Manufacturer: AMD; Core Architecture: ARM; Data Bus Width: 32b; Frequency: 766MHz; Interface: CAN, EBI/EMI, Ethernet, I2C, MMC, SD, SDIO, SPI, UART, USART, USB; Max Supply Voltage: 1.05V; Min Supply Voltage: 950mV; Number of I/Os: 130; Operating Supply Voltage: 1V; Peripherals: DMA; Speed Grade: -2; Supplier: Farnell; Supplier Part Number: 2831085; Manufacturer Part Number: XC7Z010-2CLG400I; RoHS: Compliant; Category: System on Chip (SoC); Stock: 89; Pricing: 1=78,2 (EUR); Case/Package: BGA; China RoHS: Compliant; Contact Plating: Copper, Silver, Tin; Height - Seated (Max): 1.6mm; Length: 17mm; Lifecycle Status: Production; Clock Frequency: 733MHz; Max Operating Temperature: 100°C; Min Operating Temperature: -40°C; Pins: 400; Number of Terminals: 400; Radiation Hardening: No; REACH SVHC: Yes; Terminal Pitch: 800µm; Width: 17mm; ComponentLink1URL: https://datasheet.octopart.com:443/XC7Z010-2CLG400I-AMD-datasheet-159618399.pdf?src-supplier=IHS; ComponentLink1Description: https://datasheet.octopart.com:443/XC7Z010-2CLG400I-AMD-datasheet-159618399.pdf?src-supplier=IHS; ComponentLink2URL: https://datasheet.octopart.com:443/XC7Z010-2CLG400I-Xilinx-datasheet-134531205.pdf?src-supplier=Upverter; ComponentLink2Description: https://datasheet.octopart.com:443/XC7Z010-2CLG400I-Xilinx-datasheet-134531205.pdf?src-supplier=Upverter; ComponentLink3URL: https://datasheet.octopart.com:443/XC7Z010-2CLG400I-AMD-datasheet-101617038.pdf?src-supplier=Farnell; ComponentLink3Description: https://datasheet.octopart.com:443/XC7Z010-2CLG400I-AMD-datasheet-101617038.pdf?src-supplier=Farnell; ComponentLink4URL: https://datasheet.octopart.com:443/XC7Z010-2CLG400I-Xilinx-datasheet-159009919.pdf?src-supplier=Augswan; ComponentLink4Description: https://datasheet.octopart.com:443/XC7Z010-2CLG400I-Xilinx-datasheet-159009919.pdf?src-supplier=Augswan